# Altium schematic sheet opamp.SchDoc
size A4
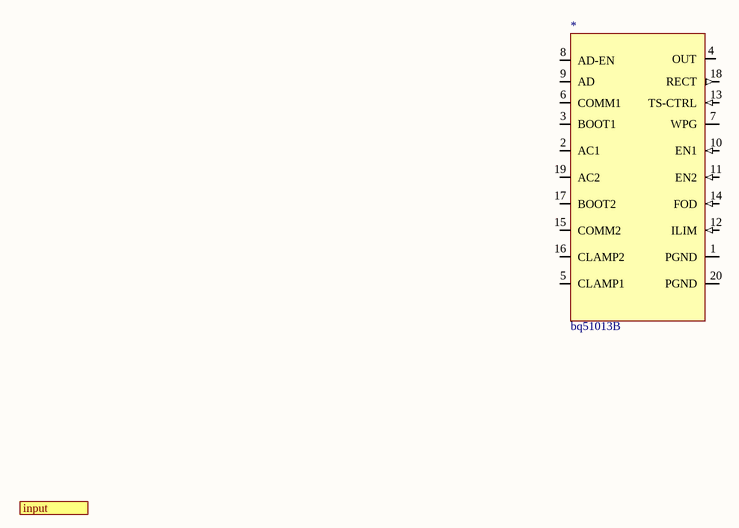
[diagram p0: opamp.SchDoc]

## Parts
*  bq51013B  [CONTROLLER_MSP430FR2522IRHLT]

## Ports
input

## Nets

Not connected (* = marked no-connect by the designer): * 1(PGND) 2(AC1) 3(BOOT1) 4(OUT) 5(CLAMP1) 6(COMM1) 7(WPG) 8(AD-EN) 9(AD) 10(EN1) 11(EN2) 12(ILIM) 13(TS-CTRL) 14(FOD) 15(COMM2) 16(CLAMP2) 17(BOOT2) 18(RECT) 19(AC2) 20(PGND)